# Altium project node_nrf52.PrjPcb
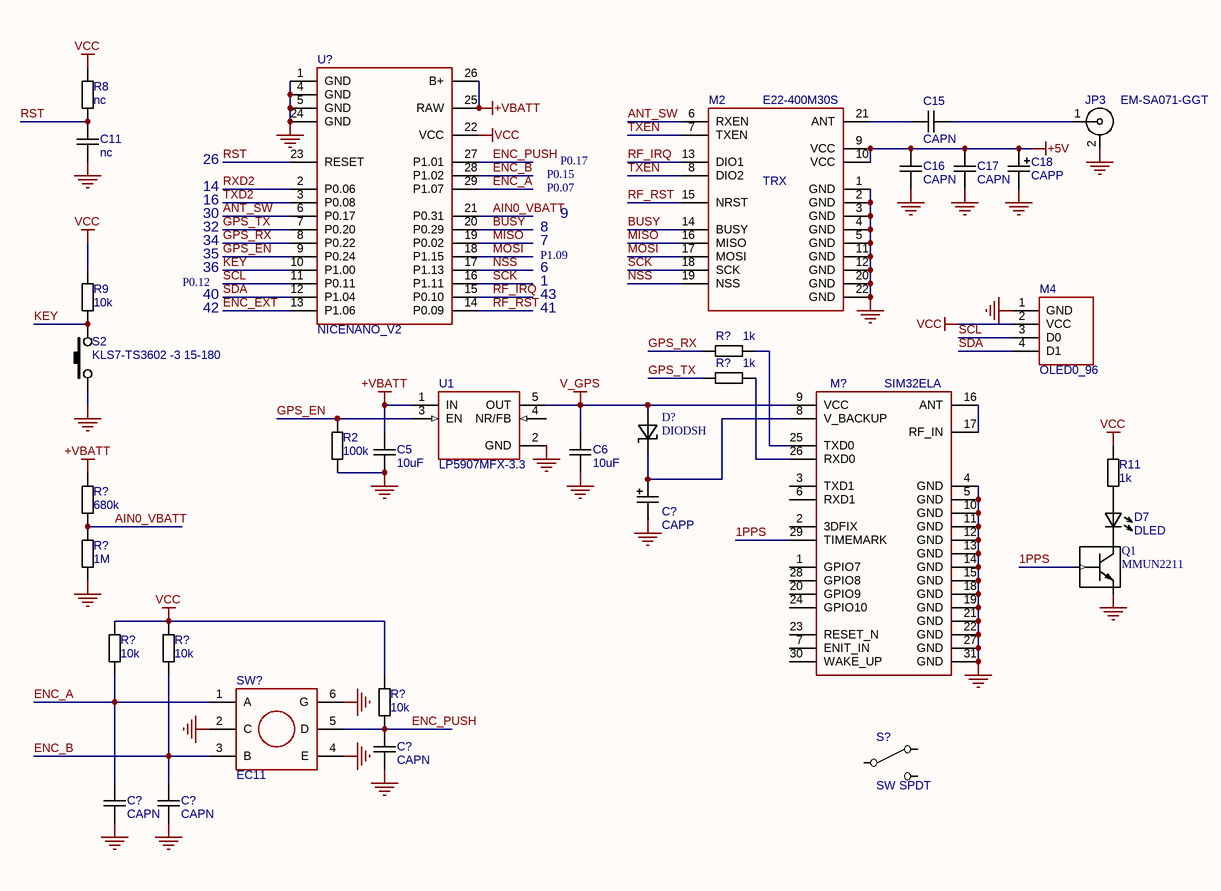
[diagram p0: node_nrf52.SchDoc]
1 sheet, 34 parts. Net scope: global (net labels, ports and power ports of the same name join across sheets).

## Sheet node_nrf52.SchDoc
size A3; SheetNumber: 1; SheetTotal: 1

### Parts
(Parts that share a designator on the sheet are numbered #1, #2 ... from top to bottom, then left to right.)
C5  10uF  [C-0805]
C6  10uF  [C-0805]
C11  nc  [C-0603]
C15  CAPN  [C-0603]
C16  CAPN  [C-0603]
C17  CAPN  [C-0603]
C18  CAPP  [C_TANTAL_C]
C?#1  CAPP  [C_TANTAL_C]
C?#2  CAPN  [C-0603]
C?#3  CAPN  [C-0603]
C?#4  CAPN  [C-0603]
D7  DLED  [LED_3mm_RED]
D?  DIODSH
JP3  EM-SA071-GGT  [SMA_F_EDGE]
M2  E22-400M30S  [PE22(400M30S)]
M4  OLED0_96  [OLED096_I2C]
M?  SIM32ELA
Q1  MMUN2211  [SOT-23]
R2  100k  [R-0603]
R8  nc  [R-0603]
R9  10k  [R-0603]
R11  1k  [R-0603]
R?#1  1k  [R-0603]
R?#2  1k  [R-0603]
R?#3  680k  [R-0603]
R?#4  1M  [R-0603]
R?#5  10k  [R-0603]
R?#6  10k  [R-0603]
R?#7  10k  [R-0603]
S2  KLS7-TS3602 -3 15-180  [KLS7-TS3602]
S?  SW SPDT  [SK-12D07VG5]
SW?  EC11  [EC11]
U1  LP5907MFX-3.3  [SOT-23-5]
U?  NICENANO_V2  [NICENANO]

### Nets
+5V: C16.1 C17.1 C18.2 M2.9(VCC) M2.10(VCC)
+VBATT: C5.1 R?#3.2 U1.1(IN) U?.25(RAW) U?.26(B+)
GND: C5.2 C6.2 C11.2 C16.2 C17.2 C18.1 C?#1.1 C?#2.2 C?#3.2 C?#4.2 JP3.2 M2.1(GND) M2.2(GND) M2.3(GND) M2.4(GND) M2.5(GND) M2.11(GND) M2.12(GND) M2.20(GND) M2.22(GND) M4.1(GND) M?.4(GND) M?.5(GND) M?.10(GND) M?.11(GND) M?.12(GND) M?.13(GND) M?.14(GND) M?.15(GND) M?.18(GND) M?.19(GND) M?.21(GND) M?.22(GND) M?.27(GND) M?.31(GND) Q1.2(EMITTER) R2.1 R?#4.1 S2.1 SW?.2(C) SW?.4(E) SW?.6(G) U1.2(GND) U?.1(GND) U?.4(GND) U?.5(GND) U?.24(GND)
V_GPS: C6.1 D?.1 M?.9(VCC) U1.5(OUT)
VCC: M4.2(VCC) R8.2 R9.1 R11.2 R?#5.1 R?#6.1 R?#7.1 U?.22(VCC)
1PPS: M?.29(TIMEMARK) Q1.1(BASE)
AIN0_VBATT: R?#3.1 R?#4.2 U?.21(P0.31)
ANT_SW: M2.6(RXEN) U?.6(P0.17)
BUSY: M2.14(BUSY) U?.20(P0.29)
ENC_A: C?#3.1 R?#5.2 SW?.1(A) U?.29(P1.07)
ENC_B: C?#4.1 R?#6.2 SW?.3(B) U?.28(P1.02)
ENC_EXT: U?.13(P1.06)
ENC_PUSH: C?#2.1 R?#7.2 SW?.5(D) U?.27(P1.01)
GPS_EN: R2.2 U1.3(EN) U?.9(P0.24)
GPS_RX: R?#1.2 U?.8(P0.22)
GPS_TX: R?#2.2 U?.7(P0.20)
KEY: R9.2 S2.2 U?.10(P1.00)
MISO: M2.16(MISO) U?.19(P0.02)
MOSI: M2.17(MOSI) U?.18(P1.15)
NSS: M2.19(NSS) U?.17(P1.13)
RF_IRQ: M2.13(DIO1) U?.15(P0.10)
RF_RST: M2.15(NRST) U?.14(P0.09)
RST: C11.1 R8.1 U?.23(RESET)
RXD2: U?.2(P0.06)
SCK: M2.18(SCK) U?.16(P1.11)
SCL: M4.3(D0) U?.11(P0.11)
SDA: M4.4(D1) U?.12(P1.04)
TXD2: U?.3(P0.08)
TXEN: M2.7(TXEN) M2.8(DIO2)
NetC15_1: C15.1 M2.21(ANT)
NetC15_2: C15.2 JP3.1
NetC?#1_2: C?#1.2 D?.2 M?.8(V_BACKUP)
NetD7_1: D7.1 R11.1
NetD7_2: D7.2 Q1.3(COLLECTOR)
NetM?_16: M?.16(ANT) M?.17(RF_IN)
NetM?_25: M?.25(TXD0) R?#1.1
NetM?_26: M?.26(RXD0) R?#2.1

Not connected (* = marked no-connect by the designer): M? 1(GPIO7) 2(3DFIX) 3(TXD1) 6(RXD1) 7(ENIT_IN) 20(GPIO9) 23(RESET_N) 24(GPIO10) 28(GPIO8) 30(WAKE_UP); S? 1(NC) 2(COMMON) 3(NO); U1 4(NR/FB)

### Notes on the sheet
- 26
- 14
- P0.07
- P0.15
- P0.17
- 16
- 30
- 32
- 34
- 7
- 8
- 9
- P0.12
- 35
- 36
- 40
- 42
- 41
- 43
- 1
- 6
- P1.09
- (in symbol E22) TRX

### Library data of the parts
C5 C6 C11 C15-C17 C?#2-C?#4 = CAPN: Voltage: 50V; Точність/група: NP0; Вид: Конденсатор
C18 C?#1 = CAPP: Voltage: 16V; Вид: Конденсатор
D7 = DLED: Вид: Світлодіод
D? = DIODSH: Вид: Діод
JP3 = SMA: SMA Female R/A PCB Mount; Вид: Роз'єм
M2 = E22
M4 = OLED0_96_I2C
M? = SIM32ELA: Вид: Модуль
Q1 = MMUN2211: Вид: Транзистор
R2 R8 R9 R11 R?#1-R?#7 = RES: Точність/група: 5%; Вид: Резистор
S2 = SW-1: Вид: Кнопка; Робоча напруга: *
S? = SW SPDT: Вид: Перемикач; Виробник: *; *: *
U1 = LP5907: 250mA Low-Dropout Regulator; Вид: Мікросхема
U? = NICENANO_V2: Вид: Мікросхема